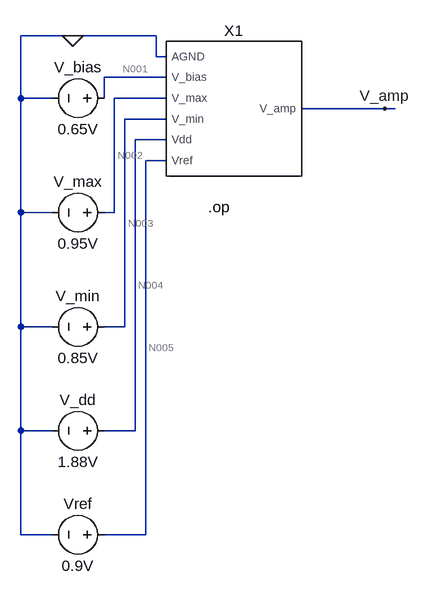
[diagram p0: schematic qrs_amp_test.asc]
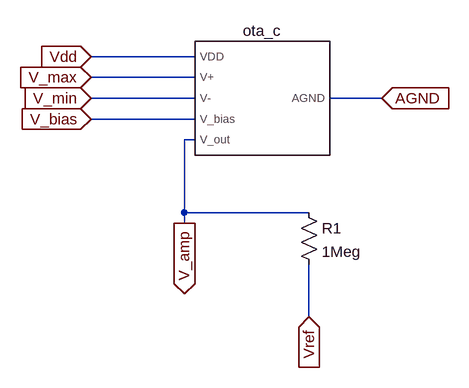
[diagram p1: sub-circuit qrs_amp.asc]
qrs_amp_test.asc, the LTspice schematic file:
Version 4.1
SHEET 1 880 928
WIRE -16 96 -96 96
WIRE 112 96 -16 96
WIRE 112 128 112 96
WIRE 128 128 112 128
WIRE 128 160 32 160
WIRE -96 192 -96 96
WIRE -48 192 -96 192
WIRE 32 192 32 160
WIRE 128 192 48 192
WIRE 464 208 336 208
WIRE 480 208 464 208
WIRE 128 224 64 224
WIRE 128 256 80 256
WIRE 128 288 96 288
WIRE -96 368 -96 192
WIRE -48 368 -96 368
WIRE 48 368 48 192
WIRE 48 368 32 368
WIRE -96 544 -96 368
WIRE -48 544 -96 544
WIRE 64 544 64 224
WIRE 64 544 32 544
WIRE -96 704 -96 544
WIRE -48 704 -96 704
WIRE 80 704 80 256
WIRE 80 704 32 704
WIRE -96 864 -96 704
WIRE -48 864 -96 864
WIRE 96 864 96 288
WIRE 96 864 32 864
FLAG -16 96 0
FLAG 464 208 V_amp
SYMBOL voltage 48 192 R90
WINDOW 0 -32 56 VBottom 2
WINDOW 3 32 56 VTop 2
SYMATTR InstName V_bias
SYMATTR Value 0.65V
SYMBOL voltage 48 368 R90
WINDOW 0 -32 56 VBottom 2
WINDOW 3 32 56 VTop 2
SYMATTR InstName V_max
SYMATTR Value 0.95V
SYMBOL voltage 48 544 R90
WINDOW 0 -32 56 VBottom 2
WINDOW 3 32 56 VTop 2
SYMATTR InstName V_min
SYMATTR Value 0.85V
SYMBOL voltage 48 704 R90
WINDOW 0 -32 56 VBottom 2
WINDOW 3 32 56 VTop 2
SYMATTR InstName V_dd
SYMATTR Value 1.88V
SYMBOL voltage 48 864 R90
WINDOW 0 -32 56 VBottom 2
WINDOW 3 32 56 VTop 2
SYMATTR InstName Vref
SYMATTR Value 0.9V
SYMBOL qrs_amp 224 208 R0
SYMATTR InstName X1
TEXT 192 360 Left 2 !.op

qrs_amp.asc, the sub-circuit schematic file:
Version 4.1
SHEET 1 880 680
WIRE 96 112 -64 112
WIRE 96 144 -64 144
WIRE 96 176 -64 176
WIRE 384 176 304 176
WIRE 96 208 -64 208
WIRE 96 240 80 240
WIRE 80 352 80 240
WIRE 272 352 80 352
WIRE 80 368 80 352
WIRE 272 512 272 432
FLAG -64 144 V_max
IOPIN -64 144 In
FLAG -64 176 V_min
IOPIN -64 176 In
FLAG 80 368 V_amp
IOPIN 80 368 Out
FLAG -64 112 Vdd
IOPIN -64 112 In
FLAG -64 208 V_bias
IOPIN -64 208 In
FLAG 384 176 AGND
IOPIN 384 176 In
FLAG 272 512 Vref
IOPIN 272 512 In
SYMBOL ota_core 192 176 R0
SYMATTR InstName ota_c
SYMBOL res 256 336 R0
SYMATTR InstName R1
SYMATTR Value 1Meg

The netlist it stands for:
* qrs_amp_test.asc
V_bias N001 0 0.65V
V_max N002 0 0.95V
V_min N003 0 0.85V
V_dd N004 0 1.88V
Vref N005 0 0.9V
X§X1 0 N001 N002 N003 N004 N005 V_amp qrs_amp

* block symbol definitions
.subckt qrs_amp AGND V_bias V_max V_min Vdd Vref V_amp
X§ota_c Vdd V_max V_min V_bias V_amp AGND ota_core  ; pins VDD V+ V- V_bias V_out AGND
R1 V_amp Vref 1Meg
.ends qrs_amp

.op
.backanno
.end

* Results of the author's LTspice run, read from the files saved beside the schematic
* Operating Point:
*   V(n001) = 650 mV
*   V(n002) = 950 mV
*   V(n003) = 850 mV
*   V(n004) = 1.88 V
*   V(n005) = 900 mV
*   V(v_amp) = 1.224 V
*   I(V_bias) = 0 A
*   I(V_dd) = -644.6 nA
*   I(V_max) = 0 A
*   I(V_min) = 0 A
*   I(Vref) = 324 nA
*   Ix(x1:agnd) = -320.5 nA
*   Ix(x1:v_amp) = 0 A
*   Ix(x1:v_bias) = 0 A
*   Ix(x1:v_max) = 0 A
*   Ix(x1:v_min) = 0 A
*   Ix(x1:vdd) = 644.6 nA
*   Ix(x1:vref) = -324 nA